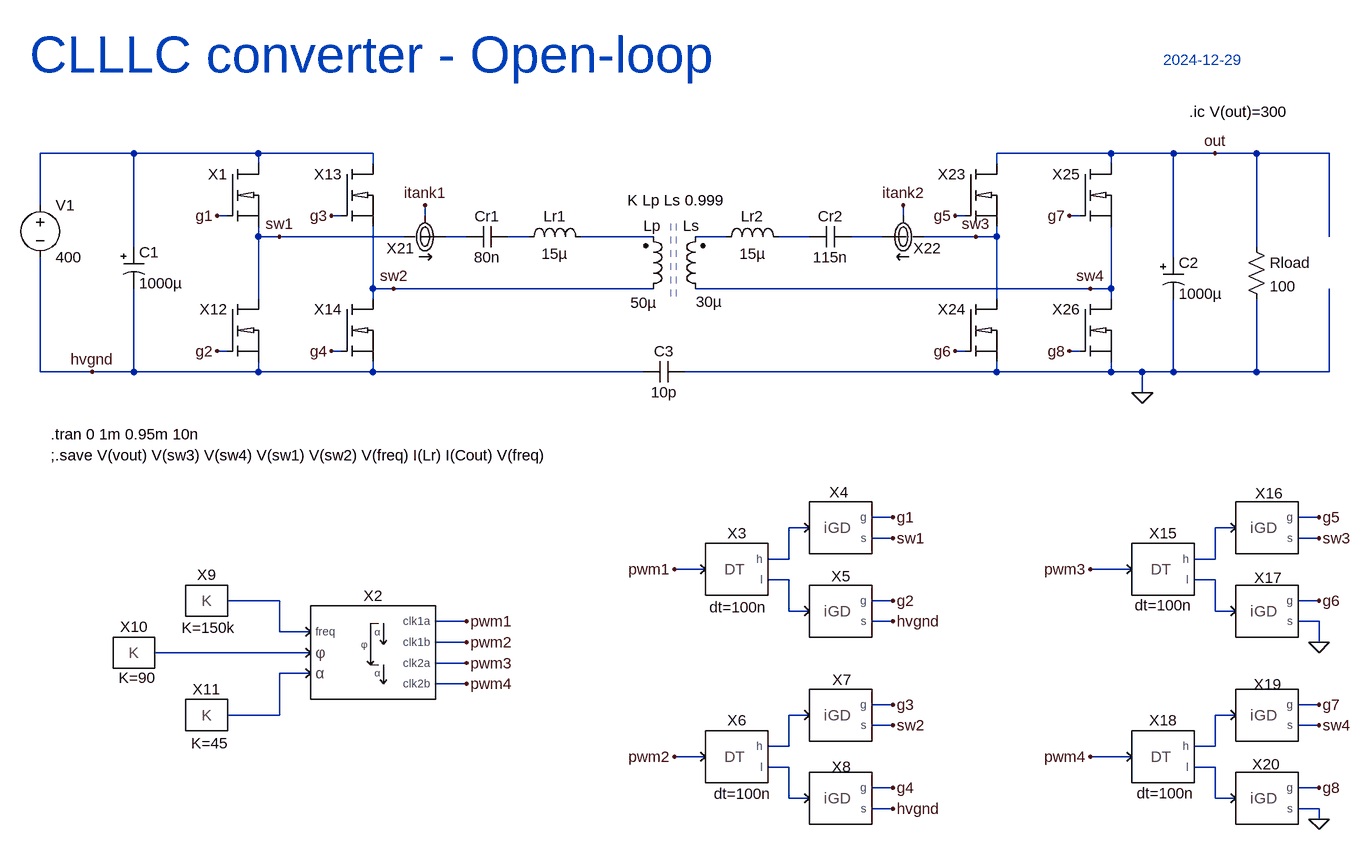
[diagram p0: schematic CLLC_Openloop.asc]
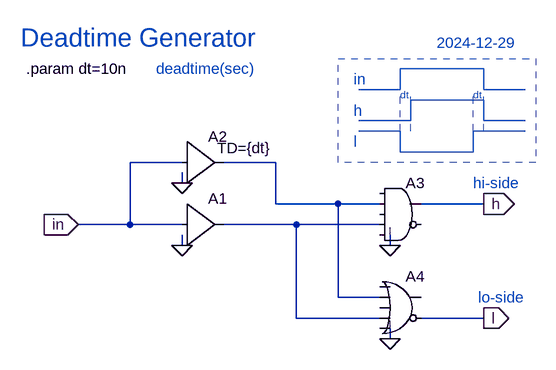
[diagram p1: sub-circuit deadtime.asc]
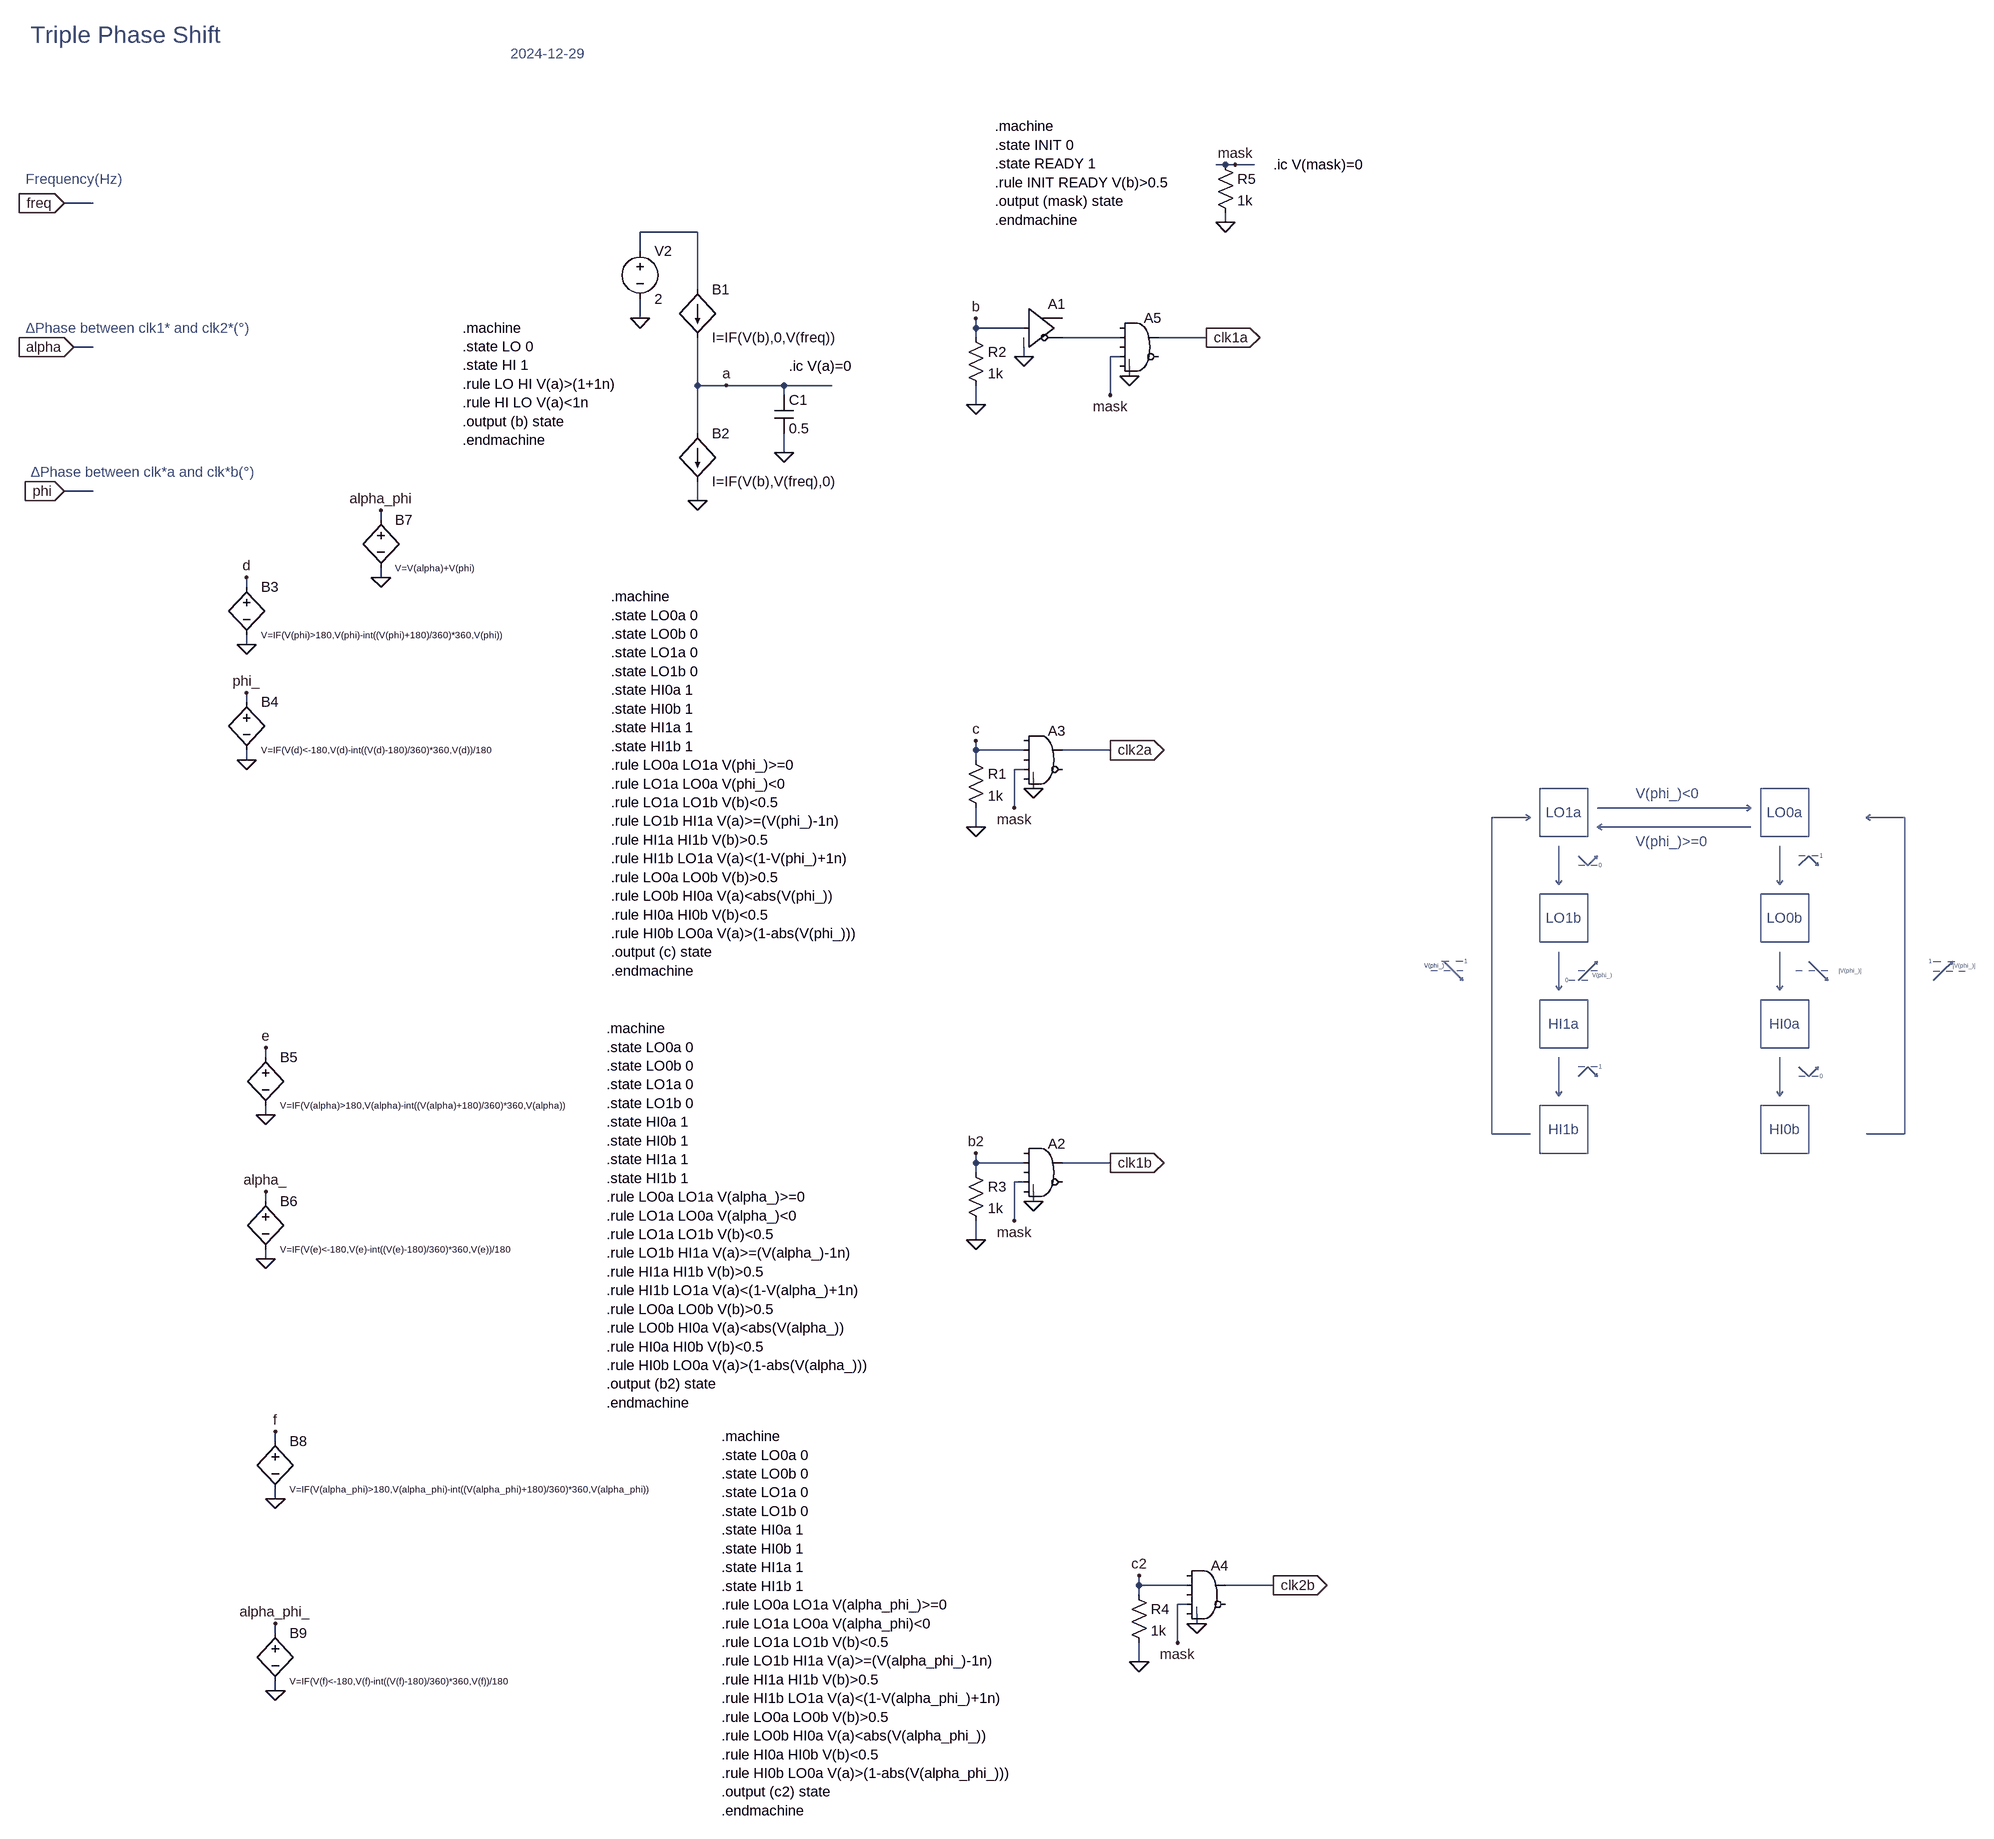
[diagram p2: sub-circuit phaseshift3.asc]
CLLC_Openloop.asc, the LTspice schematic file:
Version 4
SHEET 1 2384 1372
WIRE -80 -16 -224 -16
WIRE 112 -16 -80 -16
WIRE 288 -16 112 -16
WIRE 1424 -16 1248 -16
WIRE 1520 -16 1424 -16
WIRE 1584 -16 1520 -16
WIRE 1648 -16 1584 -16
WIRE 1760 -16 1648 -16
WIRE 112 0 112 -16
WIRE 288 0 288 -16
WIRE 1248 0 1248 -16
WIRE 1424 0 1424 -16
WIRE -224 64 -224 -16
WIRE 64 80 48 80
WIRE 240 80 224 80
WIRE 368 80 368 64
WIRE 1104 80 1104 64
WIRE 1200 80 1184 80
WIRE 1376 80 1360 80
WIRE 112 112 112 96
WIRE 144 112 112 112
WIRE 336 112 144 112
WIRE 432 112 400 112
WIRE 528 112 496 112
WIRE 720 112 608 112
WIRE 832 112 784 112
WIRE 960 112 912 112
WIRE 1072 112 1024 112
WIRE 1216 112 1136 112
WIRE 1248 112 1248 96
WIRE 1248 112 1216 112
WIRE 1760 112 1760 -16
WIRE -80 128 -80 -16
WIRE 1648 128 1648 -16
WIRE 1520 144 1520 -16
WIRE 288 192 288 96
WIRE 320 192 288 192
WIRE 720 192 320 192
WIRE 1392 192 784 192
WIRE 1424 192 1424 96
WIRE 1424 192 1392 192
WIRE 112 208 112 112
WIRE 288 208 288 192
WIRE 1248 208 1248 112
WIRE 1424 208 1424 192
WIRE 64 288 48 288
WIRE 240 288 224 288
WIRE 1200 288 1184 288
WIRE 1376 288 1360 288
WIRE -224 320 -224 144
WIRE -144 320 -224 320
WIRE -80 320 -80 192
WIRE -80 320 -144 320
WIRE 112 320 112 304
WIRE 112 320 -80 320
WIRE 288 320 288 304
WIRE 288 320 112 320
WIRE 704 320 288 320
WIRE 1248 320 1248 304
WIRE 1248 320 768 320
WIRE 1424 320 1424 304
WIRE 1424 320 1248 320
WIRE 1472 320 1424 320
WIRE 1520 320 1520 208
WIRE 1520 320 1472 320
WIRE 1648 320 1648 208
WIRE 1648 320 1520 320
WIRE 1760 320 1760 192
WIRE 1760 320 1648 320
WIRE 1472 352 1472 320
WIRE 1088 544 1056 544
WIRE 1744 544 1712 544
WIRE 960 560 928 560
WIRE 1616 560 1584 560
WIRE 1088 576 1056 576
WIRE 1744 576 1712 576
WIRE 928 608 928 560
WIRE 928 608 896 608
WIRE 1584 608 1584 560
WIRE 1584 608 1552 608
WIRE 800 624 752 624
WIRE 1456 624 1392 624
WIRE 928 640 896 640
WIRE 1584 640 1552 640
WIRE 144 672 64 672
WIRE 1088 672 1056 672
WIRE 1744 672 1712 672
WIRE 928 688 928 640
WIRE 960 688 928 688
WIRE 1584 688 1584 640
WIRE 1616 688 1584 688
WIRE 432 704 384 704
WIRE 1088 704 1056 704
WIRE 1744 704 1712 704
WIRE 144 720 144 672
WIRE 192 720 144 720
WIRE 432 736 384 736
WIRE 1744 736 1744 704
WIRE 192 752 -48 752
WIRE 432 768 384 768
WIRE 192 784 144 784
WIRE 432 800 384 800
WIRE 1088 832 1056 832
WIRE 1744 832 1712 832
WIRE 144 848 144 784
WIRE 144 848 64 848
WIRE 960 848 928 848
WIRE 1616 848 1584 848
WIRE 1088 864 1056 864
WIRE 1744 864 1712 864
WIRE 928 896 928 848
WIRE 928 896 896 896
WIRE 1584 896 1584 848
WIRE 1584 896 1552 896
WIRE 800 912 752 912
WIRE 1456 912 1392 912
WIRE 928 928 896 928
WIRE 1584 928 1552 928
WIRE 1088 960 1056 960
WIRE 1744 960 1712 960
WIRE 928 976 928 928
WIRE 960 976 928 976
WIRE 1584 976 1584 928
WIRE 1616 976 1584 976
WIRE 1088 992 1056 992
WIRE 1744 992 1712 992
WIRE 1744 1008 1744 992
FLAG 48 80 g1
FLAG 48 288 g2
FLAG 144 112 sw1
FLAG 224 80 g3
FLAG 224 288 g4
FLAG 320 192 sw2
FLAG 1584 -16 out
FLAG 1088 544 g1
FLAG 1088 576 sw1
FLAG 1088 672 g2
FLAG 1088 832 g3
FLAG 1088 864 sw2
FLAG 1088 960 g4
FLAG -144 320 hvgnd
FLAG 1088 992 hvgnd
FLAG 1088 704 hvgnd
FLAG 1216 112 sw3
FLAG 1392 192 sw4
FLAG 1472 352 0
FLAG 1184 80 g5
FLAG 1184 288 g6
FLAG 1360 80 g7
FLAG 1360 288 g8
FLAG 1744 544 g5
FLAG 1744 576 sw3
FLAG 1744 672 g6
FLAG 1744 832 g7
FLAG 1744 864 sw4
FLAG 1744 960 g8
FLAG 1744 1008 0
FLAG 1744 736 0
FLAG 368 64 itank1
FLAG 1104 64 itank2
FLAG 752 912 pwm2
FLAG 432 736 pwm2
FLAG 432 704 pwm1
FLAG 432 800 pwm4
FLAG 432 768 pwm3
FLAG 752 624 pwm1
FLAG 1392 624 pwm3
FLAG 1392 912 pwm4
SYMBOL voltage -224 48 R0
WINDOW 123 0 0 Left 0
WINDOW 39 0 0 Left 0
SYMATTR InstName V1
SYMATTR Value 400
SYMBOL ind2 704 208 M180
WINDOW 0 0 113 Left 2
WINDOW 3 -20 -6 Left 2
SYMATTR InstName Lp
SYMATTR Value 50µ
SYMATTR SpiceLine Rser=1m
SYMBOL ind2 800 208 R180
WINDOW 0 9 113 Left 2
WINDOW 3 -26 -4 Left 2
SYMATTR InstName Ls
SYMATTR Value 30µ
SYMATTR SpiceLine Rser=1m
SYMBOL DEADTIME 848 624 R0
WINDOW 39 2 74 Bottom 2
SYMATTR SpiceLine dt=100n
SYMATTR InstName X3
SYMBOL iGD 1008 560 R0
WINDOW 0 -3 -70 Top 2
SYMATTR InstName X4
SYMBOL iGD 1008 688 R0
WINDOW 0 0 -69 Top 2
SYMATTR InstName X5
SYMBOL DEADTIME 848 912 R0
WINDOW 39 9 73 Bottom 2
SYMATTR SpiceLine dt=100n
SYMATTR InstName X6
SYMBOL iGD 1008 848 R0
WINDOW 0 2 -70 Top 2
SYMATTR InstName X7
SYMBOL iGD 1008 976 R0
WINDOW 0 1 -64 Top 2
SYMATTR InstName X8
SYMBOL cap 496 96 R90
WINDOW 0 0 32 VBottom 2
WINDOW 3 32 32 VTop 2
SYMATTR InstName Cr1
SYMATTR Value 80n
SYMBOL ind 512 128 R270
WINDOW 0 32 56 VTop 2
WINDOW 3 5 56 VBottom 2
SYMATTR InstName Lr1
SYMATTR Value 15µ
SYMATTR SpiceLine Rser=10m
SYMBOL ind 816 128 R270
WINDOW 0 32 56 VTop 2
WINDOW 3 5 56 VBottom 2
SYMATTR InstName Lr2
SYMATTR Value 15µ
SYMATTR SpiceLine Rser=10m
SYMBOL cap 1024 96 R90
WINDOW 0 0 32 VBottom 2
WINDOW 3 32 32 VTop 2
SYMATTR InstName Cr2
SYMATTR Value 115n
SYMBOL DEADTIME 1504 624 R0
WINDOW 39 1 71 Bottom 2
SYMATTR SpiceLine dt=100n
SYMATTR InstName X15
SYMBOL iGD 1664 560 R0
WINDOW 0 3 -69 Top 2
SYMATTR InstName X16
SYMBOL iGD 1664 688 R0
WINDOW 0 2 -67 Top 2
SYMATTR InstName X17
SYMBOL DEADTIME 1504 912 R0
WINDOW 39 4 72 Bottom 2
SYMATTR SpiceLine dt=100n
SYMATTR InstName X18
SYMBOL iGD 1664 848 R0
WINDOW 0 1 -63 Top 2
SYMATTR InstName X19
SYMBOL iGD 1664 976 R0
WINDOW 0 -1 -68 Top 2
SYMATTR InstName X20
SYMBOL IMON 368 112 M180
SYMATTR InstName X21
SYMBOL IMON 1104 112 R180
SYMATTR InstName X22
SYMBOL PHASESHIFT3 288 752 R0
SYMATTR InstName X2
SYMBOL CONST 32 672 R0
WINDOW 39 3 57 Bottom 2
SYMATTR SpiceLine K=150k
SYMATTR InstName X9
SYMBOL CONST -80 752 R0
WINDOW 39 5 54 Bottom 2
SYMATTR SpiceLine K=90
SYMATTR InstName X10
SYMBOL CONST 32 848 R0
WINDOW 39 5 59 Bottom 2
SYMATTR SpiceLine K=45
SYMATTR InstName X11
SYMBOL polcap -96 128 R0
WINDOW 3 24 56 Left 2
SYMATTR Value 1000µ
SYMATTR InstName C1
SYMATTR Description Capacitor
SYMATTR Type cap
SYMATTR SpiceLine Rser=0.03
SYMBOL polcap 1504 144 R0
WINDOW 3 24 56 Left 2
SYMATTR Value 1000µ
SYMATTR InstName C2
SYMATTR Description Capacitor
SYMATTR Type cap
SYMATTR SpiceLine Rser=0.03
SYMBOL res 1632 112 R0
SYMATTR InstName Rload
SYMATTR Value 100
SYMBOL cap 768 304 R90
WINDOW 0 0 32 VBottom 2
WINDOW 3 32 32 VTop 2
SYMATTR InstName C3
SYMATTR Value 10p
SYMBOL iNMOS 112 48 R0
SYMATTR InstName X1
SYMBOL iNMOS 112 256 R0
SYMATTR InstName X12
SYMBOL iNMOS 288 48 R0
SYMATTR InstName X13
SYMBOL iNMOS 288 256 R0
SYMATTR InstName X14
SYMBOL iNMOS 1248 48 R0
SYMATTR InstName X23
SYMBOL iNMOS 1248 256 R0
SYMATTR InstName X24
SYMBOL iNMOS 1424 48 R0
SYMATTR InstName X25
SYMBOL iNMOS 1424 256 R0
SYMATTR InstName X26
TEXT 680 56 Left 2 !K Lp Ls 0.999
TEXT -208 416 Left 2 !.tran 0 1m 0.95m 10n
TEXT -240 -168 Left 6 ;CLLLC converter - Open-loop
TEXT -208 448 Left 2 !;.save V(vout) V(sw3) V(sw4) V(sw1) V(sw2) V(freq) I(Lr) I(Cout) V(freq)
TEXT 1544 -80 Left 2 !.ic V(out)=300
TEXT 1504 -160 Left 2 ;2024-12-29
LINE Normal 747 204 747 92 1
LINE Normal 755 204 755 92 1

deadtime.asc, the sub-circuit schematic file:
Version 4
SHEET 1 1412 1312
WIRE 64 288 -16 288
WIRE 208 288 128 288
WIRE 64 320 64 304
WIRE 208 352 208 288
WIRE 304 352 208 352
WIRE 368 352 304 352
WIRE 528 352 432 352
WIRE -16 384 -16 288
WIRE -16 384 -96 384
WIRE 64 384 -16 384
WIRE 240 384 128 384
WIRE 368 384 240 384
WIRE 64 416 64 400
WIRE 384 416 384 400
WIRE 304 496 304 352
WIRE 368 496 304 496
WIRE 240 528 240 384
WIRE 368 528 240 528
WIRE 528 528 432 528
WIRE 384 560 384 544
FLAG -96 384 in
IOPIN -96 384 In
FLAG 64 416 0
FLAG 64 320 0
FLAG 384 416 0
FLAG 384 560 0
FLAG 528 352 h
IOPIN 528 352 Out
FLAG 528 528 l
IOPIN 528 528 Out
SYMBOL Digital\\buf1 64 320 R0
SYMATTR InstName A1
SYMBOL Digital\\buf1 64 224 R0
WINDOW 3 54 42 Left 2
SYMATTR Value TD={dt}
SYMATTR InstName A2
SYMBOL Digital\\and 400 304 R0
SYMATTR InstName A3
SYMBOL Digital\\or 400 448 R0
SYMATTR InstName A4
TEXT -176 144 Left 2 !.param dt=10n
TEXT -184 96 Left 4 ;Deadtime Generator
TEXT 24 144 Left 2 ;deadtime(sec)
TEXT 512 320 Left 2 ;hi-side
TEXT 520 496 Left 2 ;lo-side
TEXT 328 160 Left 2 ;in
TEXT 328 208 Left 2 ;h
TEXT 328 256 Left 2 ;l
TEXT 400 184 Left 1 ;dt
TEXT 512 184 Left 1 ;dt
TEXT 456 104 Left 2 ;2024-12-29
LINE Normal 400 176 336 176
LINE Normal 400 176 400 144
LINE Normal 528 144 400 144
LINE Normal 528 176 528 144
LINE Normal 592 176 528 176
LINE Normal 416 224 336 224
LINE Normal 416 224 416 192
LINE Normal 528 192 416 192
LINE Normal 528 224 528 192
LINE Normal 592 224 528 224
LINE Normal 400 240 336 240
LINE Normal 400 272 400 240
LINE Normal 512 272 400 272
LINE Normal 512 272 512 240
LINE Normal 592 240 512 240
LINE Normal 400 240 400 176 2
LINE Normal 512 240 512 176 2
LINE Normal 416 240 416 176 2
LINE Normal 528 240 528 176 2
RECTANGLE Normal 608 288 304 128 2

phaseshift3.asc, the sub-circuit schematic file:
Version 4
SHEET 1 2476 2456
WIRE 752 -240 736 -240
WIRE 768 -240 752 -240
WIRE 800 -240 768 -240
WIRE -1136 -176 -1184 -176
WIRE 752 -144 752 -160
WIRE -128 -128 -224 -128
WIRE -224 -96 -224 -128
WIRE -128 -32 -128 -128
WIRE -224 16 -224 -16
WIRE 336 32 336 16
WIRE 416 32 336 32
WIRE 336 48 336 32
WIRE 576 48 480 48
WIRE 720 48 640 48
WIRE -1136 64 -1168 64
WIRE 416 80 416 64
WIRE 576 80 560 80
WIRE 592 112 592 96
WIRE -128 128 -128 48
WIRE -80 128 -128 128
WIRE 16 128 -80 128
WIRE 96 128 16 128
WIRE 16 144 16 128
WIRE 560 144 560 80
WIRE 336 160 336 128
WIRE -128 208 -128 128
WIRE 16 240 16 208
WIRE -1136 304 -1184 304
WIRE -128 320 -128 288
WIRE -656 352 -656 336
WIRE -656 448 -656 432
WIRE -880 464 -880 448
WIRE -880 560 -880 544
WIRE -880 656 -880 640
WIRE 336 736 336 720
WIRE 416 736 336 736
WIRE 560 736 480 736
WIRE -880 752 -880 736
WIRE 336 752 336 736
WIRE 416 768 400 768
WIRE 432 800 432 784
WIRE 400 832 400 768
WIRE 336 864 336 832
WIRE -848 1248 -848 1232
WIRE -848 1344 -848 1328
WIRE 336 1424 336 1408
WIRE 416 1424 336 1424
WIRE 560 1424 480 1424
WIRE 336 1440 336 1424
WIRE 416 1456 400 1456
WIRE -848 1488 -848 1472
WIRE 432 1488 432 1472
WIRE 400 1520 400 1456
WIRE 336 1552 336 1520
WIRE -848 1584 -848 1568
WIRE -832 1888 -832 1872
WIRE -832 1984 -832 1968
WIRE 608 2128 608 2112
WIRE 688 2128 608 2128
WIRE 832 2128 752 2128
WIRE 608 2144 608 2128
WIRE 688 2160 672 2160
WIRE 704 2192 704 2176
WIRE -832 2208 -832 2192
WIRE 672 2224 672 2160
WIRE 608 2256 608 2224
WIRE -832 2304 -832 2288
FLAG -1184 -176 freq
IOPIN -1184 -176 In
FLAG 16 240 0
FLAG -224 16 0
FLAG -1168 64 alpha
IOPIN -1168 64 In
FLAG -128 320 0
FLAG 336 160 0
FLAG -80 128 a
FLAG -880 560 0
FLAG -880 448 d
FLAG 720 48 clk1a
IOPIN 720 48 Out
FLAG 336 16 b
FLAG 336 864 0
FLAG 560 736 clk2a
IOPIN 560 736 Out
FLAG 336 720 c
FLAG -880 752 0
FLAG -880 640 phi_
FLAG 336 1552 0
FLAG 560 1424 clk1b
IOPIN 560 1424 Out
FLAG 336 1408 b2
FLAG 608 2256 0
FLAG 832 2128 clk2b
IOPIN 832 2128 Out
FLAG 608 2112 c2
FLAG -1184 304 phi
IOPIN -1184 304 In
FLAG -848 1344 0
FLAG -848 1232 e
FLAG -848 1584 0
FLAG -848 1472 alpha_
FLAG -656 448 0
FLAG -656 336 alpha_phi
FLAG -832 1984 0
FLAG -832 1872 f
FLAG -832 2304 0
FLAG -832 2192 alpha_phi_
FLAG 416 80 0
FLAG 592 112 0
FLAG 560 144 mask
FLAG 432 800 0
FLAG 400 832 mask
FLAG 432 1488 0
FLAG 400 1520 mask
FLAG 704 2192 0
FLAG 672 2224 mask
FLAG 752 -144 0
FLAG 768 -240 mask
SYMBOL cap 0 144 R0
SYMATTR InstName C1
SYMATTR Value 0.5
SYMBOL voltage -224 -112 R0
WINDOW 123 0 0 Left 0
WINDOW 39 0 0 Left 0
SYMATTR InstName V2
SYMATTR Value 2
SYMBOL bi -128 -32 R0
SYMATTR InstName B1
SYMATTR Value I=IF(V(b),0,V(freq))
SYMBOL bi -128 208 R0
SYMATTR InstName B2
SYMATTR Value I=IF(V(b),V(freq),0)
SYMBOL res 320 32 R0
SYMATTR InstName R2
SYMATTR Value 1k
SYMBOL bv -880 448 R0
WINDOW 3 24 96 Left 1
SYMATTR Value V=IF(V(phi)>180,V(phi)-int((V(phi)+180)/360)*360,V(phi))
SYMATTR InstName B3
SYMBOL Digital\\buf 416 -32 R0
SYMATTR InstName A1
SYMBOL res 320 736 R0
SYMATTR InstName R1
SYMATTR Value 1k
SYMBOL bv -880 640 R0
WINDOW 3 24 96 Left 1
SYMATTR Value V=IF(V(d)<-180,V(d)-int((V(d)-180)/360)*360,V(d))/180
SYMATTR InstName B4
SYMBOL res 320 1424 R0
SYMATTR InstName R3
SYMATTR Value 1k
SYMBOL res 592 2128 R0
SYMATTR InstName R4
SYMATTR Value 1k
SYMBOL bv -848 1232 R0
WINDOW 3 24 96 Left 1
SYMATTR Value V=IF(V(alpha)>180,V(alpha)-int((V(alpha)+180)/360)*360,V(alpha))
SYMATTR InstName B5
SYMBOL bv -848 1472 R0
WINDOW 3 24 96 Left 1
SYMATTR Value V=IF(V(e)<-180,V(e)-int((V(e)-180)/360)*360,V(e))/180
SYMATTR InstName B6
SYMBOL bv -656 336 R0
WINDOW 3 24 96 Left 1
SYMATTR Value V=V(alpha)+V(phi)
SYMATTR InstName B7
SYMBOL bv -832 1872 R0
WINDOW 3 24 96 Left 1
SYMATTR Value V=IF(V(alpha_phi)>180,V(alpha_phi)-int((V(alpha_phi)+180)/360)*360,V(alpha_phi))
SYMATTR InstName B8
SYMBOL bv -832 2192 R0
WINDOW 3 24 96 Left 1
SYMATTR Value V=IF(V(f)<-180,V(f)-int((V(f)-180)/360)*360,V(f))/180
SYMATTR InstName B9
SYMBOL Digital\\and 608 0 R0
SYMATTR InstName A5
SYMBOL Digital\\and 448 688 R0
SYMATTR InstName A3
SYMBOL Digital\\and 448 1376 R0
SYMATTR InstName A2
SYMBOL Digital\\and 720 2080 R0
SYMATTR InstName A4
SYMBOL res 736 -256 R0
SYMATTR InstName R5
SYMATTR Value 1k
TEXT -520 32 Left 2 !.machine\n.state LO 0\n.state HI 1\n.rule LO HI V(a)>(1+1n)\n.rule HI LO V(a)<1n\n.output (b) state\n.endmachine
TEXT 24 96 Left 2 !.ic V(a)=0
TEXT -272 480 Left 2 !.machine\n.state LO0a 0\n.state LO0b 0\n.state LO1a 0\n.state LO1b 0\n.state HI0a 1\n.state HI0b 1\n.state HI1a 1\n.state HI1b 1\n.rule LO0a LO1a V(phi_)>=0\n.rule LO1a LO0a V(phi_)<0\n.rule LO1a LO1b V(b)<0.5\n.rule LO1b HI1a V(a)>=(V(phi_)-1n)\n.rule HI1a HI1b V(b)>0.5\n.rule HI1b LO1a V(a)<(1-V(phi_)+1n)\n.rule LO0a LO0b V(b)>0.5\n.rule LO0b HI0a V(a)<abs(V(phi_))\n.rule HI0a HI0b V(b)<0.5\n.rule HI0b LO0a V(a)>(1-abs(V(phi_)))\n.output (c) state\n.endmachine
TEXT 832 -240 Left 2 !.ic V(mask)=0
TEXT -280 1200 Left 2 !.machine\n.state LO0a 0\n.state LO0b 0\n.state LO1a 0\n.state LO1b 0\n.state HI0a 1\n.state HI0b 1\n.state HI1a 1\n.state HI1b 1\n.rule LO0a LO1a V(alpha_)>=0\n.rule LO1a LO0a V(alpha_)<0\n.rule LO1a LO1b V(b)<0.5\n.rule LO1b HI1a V(a)>=(V(alpha_)-1n)\n.rule HI1a HI1b V(b)>0.5\n.rule HI1b LO1a V(a)<(1-V(alpha_)+1n)\n.rule LO0a LO0b V(b)>0.5\n.rule LO0b HI0a V(a)<abs(V(alpha_))\n.rule HI0a HI0b V(b)<0.5\n.rule HI0b LO0a V(a)>(1-abs(V(alpha_)))\n.output (b2) state\n.endmachine
TEXT -88 1880 Left 2 !.machine\n.state LO0a 0\n.state LO0b 0\n.state LO1a 0\n.state LO1b 0\n.state HI0a 1\n.state HI0b 1\n.state HI1a 1\n.state HI1b 1\n.rule LO0a LO1a V(alpha_phi_)>=0\n.rule LO1a LO0a V(alpha_phi)<0\n.rule LO1a LO1b V(b)<0.5\n.rule LO1b HI1a V(a)>=(V(alpha_phi_)-1n)\n.rule HI1a HI1b V(b)>0.5\n.rule HI1b LO1a V(a)<(1-V(alpha_phi_)+1n)\n.rule LO0a LO0b V(b)>0.5\n.rule LO0b HI0a V(a)<abs(V(alpha_phi_))\n.rule HI0a HI0b V(b)<0.5\n.rule HI0b LO0a V(a)>(1-abs(V(alpha_phi_)))\n.output (c2) state\n.endmachine
TEXT 368 -304 Left 2 !.machine\n.state INIT 0\n.state READY 1\n.rule INIT READY V(b)>0.5\n.output (mask) state\n.endmachine
TEXT 1416 840 Center 2 ;LO1a
TEXT 1784 840 Center 2 ;LO0a
TEXT 1536 808 Left 2 ;V(phi_)<0
TEXT 1656 888 Right 2 ;V(phi_)>=0
TEXT 1480 928 Right 0 ;0
TEXT 1416 1016 Center 2 ;LO1b
TEXT 1496 1112 Right 0 ;V(phi_)
TEXT 1424 1120 Right 0 ;0
TEXT 1416 1192 Center 2 ;HI1a
TEXT 1480 1264 Right 0 ;1
TEXT 1416 1368 Center 2 ;HI1b
TEXT 1256 1088 Right 0 ;1
TEXT 1216 1096 Right 0 ;V(phi_)
TEXT 1784 1016 Center 2 ;LO0b
TEXT 1784 1192 Center 2 ;HI0a
TEXT 1784 1368 Center 2 ;HI0b
TEXT 1848 912 Right 0 ;1
TEXT 1216 1096 Right 0 ;V(phi_)
TEXT 1912 1104 Right 0 ;|V(phi_)|
TEXT 1848 1280 Right 0 ;0
TEXT 2024 1088 Left 0 ;1
TEXT 2064 1096 Left 0 ;|V(phi_)|
TEXT -1240 -480 Left 4 ;Triple Phase Shift
TEXT -1248 -216 Left 2 ;Frequency(Hz)
TEXT -1248 32 Left 2 ;ΔPhase between clk1* and clk2*(°)
TEXT -1240 272 Left 2 ;ΔPhase between clk*a and clk*b(°)
TEXT -440 -448 Left 2 ;2024-12-29
LINE Normal 1728 832 1472 832
LINE Normal 1728 832 1728 832 2
LINE Normal 1721 837 1728 832
LINE Normal 1728 832 1721 827
LINE Normal 1472 864 1728 864
LINE Normal 1472 864 1472 864 2
LINE Normal 1479 869 1472 864
LINE Normal 1472 864 1479 859
LINE Normal 1408 960 1408 896
LINE Normal 1408 960 1408 960 2
LINE Normal 1413 953 1408 960
LINE Normal 1408 960 1403 953
LINE Normal 1456 928 1440 912
LINE Normal 1472 912 1456 928
LINE Normal 1472 928 1440 928 2
LINE Normal 1471 917 1472 912
LINE Normal 1467 913 1472 912
LINE Normal 1408 1136 1408 1072
LINE Normal 1408 1136 1408 1136 2
LINE Normal 1413 1129 1408 1136
LINE Normal 1408 1136 1403 1129
LINE Normal 1472 1088 1456 1104
LINE Normal 1472 1104 1440 1104 2
LINE Normal 1471 1093 1472 1088
LINE Normal 1467 1089 1472 1088
LINE Normal 1456 1104 1440 1120
LINE Normal 1456 1120 1424 1120 2
LINE Normal 1408 1136 1408 1136 2
LINE Normal 1408 1312 1408 1248
LINE Normal 1408 1312 1408 1312 2
LINE Normal 1413 1305 1408 1312
LINE Normal 1408 1312 1403 1305
LINE Normal 1456 1264 1440 1280
LINE Normal 1472 1280 1456 1264
LINE Normal 1472 1264 1440 1264 2
LINE Normal 1471 1275 1472 1280
LINE Normal 1467 1279 1472 1280
LINE Normal 1360 848 1296 848
LINE Normal 1360 848 1360 848 2
LINE Normal 1353 843 1360 848
LINE Normal 1360 848 1353 853
LINE Normal 1296 1376 1296 848
LINE Normal 1296 1376 1360 1376
LINE Normal 1232 1104 1216 1088
LINE Normal 1248 1120 1232 1104
LINE Normal 1248 1104 1184 1104 2
LINE Normal 1247 1115 1248 1120
LINE Normal 1243 1119 1248 1120
LINE Normal 1248 1088 1200 1088 2
LINE Normal 1776 960 1776 896
LINE Normal 1776 960 1776 960 2
LINE Normal 1781 953 1776 960
LINE Normal 1776 960 1771 953
LINE Normal 1776 1136 1776 1072
LINE Normal 1776 1136 1776 1136 2
LINE Normal 1781 1129 1776 1136
LINE Normal 1776 1136 1771 1129
LINE Normal 1776 1136 1776 1136 2
LINE Normal 1776 1312 1776 1248
LINE Normal 1776 1312 1776 1312 2
LINE Normal 1781 1305 1776 1312
LINE Normal 1776 1312 1771 1305
LINE Normal 1824 912 1808 928
LINE Normal 1840 928 1824 912
LINE Normal 1840 912 1808 912 2
LINE Normal 1839 923 1840 928
LINE Normal 1835 927 1840 928
LINE Normal 1232 1104 1216 1088
LINE Normal 1248 1120 1232 1104
LINE Normal 1248 1104 1184 1104 2
LINE Normal 1247 1115 1248 1120
LINE Normal 1243 1119 1248 1120
LINE Normal 1248 1088 1200 1088 2
LINE Normal 1840 1104 1824 1088
LINE Normal 1856 1120 1840 1104
LINE Normal 1856 1104 1792 1104 2
LINE Normal 1855 1115 1856 1120
LINE Normal 1851 1119 1856 1120
LINE Normal 1840 1104 1824 1088
LINE Normal 1856 1120 1840 1104
LINE Normal 1856 1104 1792 1104 2
LINE Normal 1855 1115 1856 1120
LINE Normal 1851 1119 1856 1120
LINE Normal 1824 1280 1808 1264
LINE Normal 1840 1264 1824 1280
LINE Normal 1840 1280 1808 1280 2
LINE Normal 1839 1269 1840 1264
LINE Normal 1835 1265 1840 1264
LINE Normal 1920 848 1984 848
LINE Normal 1920 848 1920 848 2
LINE Normal 1927 843 1920 848
LINE Normal 1920 848 1927 853
LINE Normal 1984 1376 1984 848
LINE Normal 1984 1376 1920 1376
LINE Normal 2048 1104 2064 1088
LINE Normal 2032 1120 2048 1104
LINE Normal 2032 1104 2096 1104 2
LINE Normal 2063 1093 2064 1088
LINE Normal 2059 1089 2064 1088
LINE Normal 2032 1088 2080 1088 2
LINE Normal 2048 1104 2064 1088
LINE Normal 2032 1120 2048 1104
LINE Normal 2032 1104 2096 1104 2
LINE Normal 2063 1093 2064 1088
LINE Normal 2059 1089 2064 1088
LINE Normal 2032 1088 2080 1088 2
RECTANGLE Normal 1456 880 1376 800
RECTANGLE Normal 1824 880 1744 800
RECTANGLE Normal 1456 1056 1376 976
RECTANGLE Normal 1456 1232 1376 1152
RECTANGLE Normal 1456 1408 1376 1328
RECTANGLE Normal 1824 1056 1744 976
RECTANGLE Normal 1824 1232 1744 1152
RECTANGLE Normal 1824 1408 1744 1328

The netlist it stands for:
* CLLC_Openloop.asc
V1 N001 hvgnd 400
Lp sw2 N004 50µ Rser=1m
Ls sw4 N005 30µ Rser=1m
XX3 pwm1 N010 N008 deadtime params: dt=100n
XX4 N008 g1 sw1 iGD  ; pins in g s
XX5 N010 g2 hvgnd iGD  ; pins in g s
XX6 pwm2 N017 N015 deadtime params: dt=100n
XX7 N015 g3 sw2 iGD  ; pins in g s
XX8 N017 g4 hvgnd iGD  ; pins in g s
Cr1 N003 N002 80n
Lr1 N003 N004 15µ Rser=10m
Lr2 N005 N006 15µ Rser=10m
Cr2 N007 N006 115n
XX15 pwm3 N011 N009 deadtime params: dt=100n
XX16 N009 g5 sw3 iGD  ; pins in g s
XX17 N011 g6 0 iGD  ; pins in g s
XX18 pwm4 N018 N016 deadtime params: dt=100n
XX19 N016 g7 sw4 iGD  ; pins in g s
XX20 N018 g8 0 iGD  ; pins in g s
XX21 N002 itank1 sw1 IMON rsns=10u  ; pins n out p
XX22 N007 itank2 sw3 IMON rsns=10u  ; pins n out p
XX2 N014 N012 N013 pwm1 pwm2 pwm3 pwm4 phaseshift3
XX9 N012 CONST K=150k  ; pins K
XX10 N013 CONST K=90  ; pins K
XX11 N014 CONST K=45  ; pins K
C1 N001 hvgnd 1000µ Rser=0.03
C2 out 0 1000µ Rser=0.03
Rload out 0 100
C3 0 hvgnd 10p
XX1 N001 g1 sw1 iNMOS params: esl=1f rsnb=1k csnb=10p ron=10m  ; pins D G S
XX12 sw1 g2 hvgnd iNMOS params: esl=1f rsnb=1k csnb=10p ron=10m  ; pins D G S
XX13 N001 g3 sw2 iNMOS params: esl=1f rsnb=1k csnb=10p ron=10m  ; pins D G S
XX14 sw2 g4 hvgnd iNMOS params: esl=1f rsnb=1k csnb=10p ron=10m  ; pins D G S
XX23 out g5 sw3 iNMOS params: esl=1f rsnb=1k csnb=10p ron=10m  ; pins D G S
XX24 sw3 g6 0 iNMOS params: esl=1f rsnb=1k csnb=10p ron=10m  ; pins D G S
XX25 out g7 sw4 iNMOS params: esl=1f rsnb=1k csnb=10p ron=10m  ; pins D G S
XX26 sw4 g8 0 iNMOS params: esl=1f rsnb=1k csnb=10p ron=10m  ; pins D G S

* block symbol definitions
.subckt deadtime in l h
A1 in 0 0 0 0 0 N002 0 BUF
A2 in 0 0 0 0 0 N001 0 BUF TD={dt}
A3 0 N001 0 N002 0 0 h 0 AND
A4 0 N001 0 N002 0 l 0 0 OR
.param dt=10n
* Deadtime Generator
* deadtime(sec)
* hi-side
* lo-side
* in
* h
* l
* dt
* dt
* 2024-12-29
.ends deadtime

.subckt phaseshift3 alpha freq phi clk1a clk1b clk2a clk2b
C1 a 0 0.5
V2 N001 0 2
B1 N001 a I=IF(V(b),0,V(freq))
B2 a 0 I=IF(V(b),V(freq),0)
R2 b 0 1k
B3 d 0 V=IF(V(phi)>180,V(phi)-int((V(phi)+180)/360)*360,V(phi))
A1 b 0 0 0 0 N002 0 0 BUF
R1 c 0 1k
B4 phi_ 0 V=IF(V(d)<-180,V(d)-int((V(d)-180)/360)*360,V(d))/180
R3 b2 0 1k
R4 c2 0 1k
B5 e 0 V=IF(V(alpha)>180,V(alpha)-int((V(alpha)+180)/360)*360,V(alpha))
B6 alpha_ 0 V=IF(V(e)<-180,V(e)-int((V(e)-180)/360)*360,V(e))/180
B7 alpha_phi 0 V=V(alpha)+V(phi)
B8 f 0 V=IF(V(alpha_phi)>180,V(alpha_phi)-int((V(alpha_phi)+180)/360)*360,V(alpha_phi))
B9 alpha_phi_ 0 V=IF(V(f)<-180,V(f)-int((V(f)-180)/360)*360,V(f))/180
A5 0 N002 0 mask 0 0 clk1a 0 AND
A3 0 c 0 mask 0 0 clk2a 0 AND
A2 0 b2 0 mask 0 0 clk1b 0 AND
A4 0 c2 0 mask 0 0 clk2b 0 AND
R5 mask 0 1k
.machine
.state LO 0
.state HI 1
.rule LO HI V(a)>(1+1n)
.rule HI LO V(a)<1n
.output (b) state
.endmachine
.ic V(a)=0
.machine
.state LO0a 0
.state LO0b 0
.state LO1a 0
.state LO1b 0
.state HI0a 1
.state HI0b 1
.state HI1a 1
.state HI1b 1
.rule LO0a LO1a V(phi_)>=0
.rule LO1a LO0a V(phi_)<0
.rule LO1a LO1b V(b)<0.5
.rule LO1b HI1a V(a)>=(V(phi_)-1n)
.rule HI1a HI1b V(b)>0.5
.rule HI1b LO1a V(a)<(1-V(phi_)+1n)
.rule LO0a LO0b V(b)>0.5
.rule LO0b HI0a V(a)<abs(V(phi_))
.rule HI0a HI0b V(b)<0.5
.rule HI0b LO0a V(a)>(1-abs(V(phi_)))
.output (c) state
.endmachine
.ic V(mask)=0
.machine
.state LO0a 0
.state LO0b 0
.state LO1a 0
.state LO1b 0
.state HI0a 1
.state HI0b 1
.state HI1a 1
.state HI1b 1
.rule LO0a LO1a V(alpha_)>=0
.rule LO1a LO0a V(alpha_)<0
.rule LO1a LO1b V(b)<0.5
.rule LO1b HI1a V(a)>=(V(alpha_)-1n)
.rule HI1a HI1b V(b)>0.5
.rule HI1b LO1a V(a)<(1-V(alpha_)+1n)
.rule LO0a LO0b V(b)>0.5
.rule LO0b HI0a V(a)<abs(V(alpha_))
.rule HI0a HI0b V(b)<0.5
.rule HI0b LO0a V(a)>(1-abs(V(alpha_)))
.output (b2) state
.endmachine
.machine
.state LO0a 0
.state LO0b 0
.state LO1a 0
.state LO1b 0
.state HI0a 1
.state HI0b 1
.state HI1a 1
.state HI1b 1
.rule LO0a LO1a V(alpha_phi_)>=0
.rule LO1a LO0a V(alpha_phi)<0
.rule LO1a LO1b V(b)<0.5
.rule LO1b HI1a V(a)>=(V(alpha_phi_)-1n)
.rule HI1a HI1b V(b)>0.5
.rule HI1b LO1a V(a)<(1-V(alpha_phi_)+1n)
.rule LO0a LO0b V(b)>0.5
.rule LO0b HI0a V(a)<abs(V(alpha_phi_))
.rule HI0a HI0b V(b)<0.5
.rule HI0b LO0a V(a)>(1-abs(V(alpha_phi_)))
.output (c2) state
.endmachine
.machine
.state INIT 0
.state READY 1
.rule INIT READY V(b)>0.5
.output (mask) state
.endmachine
* LO1a
* LO0a
* V(phi_)<0
* V(phi_)>=0
* 0
* LO1b
* V(phi_)
* 0
* HI1a
* 1
* HI1b
* 1
* V(phi_)
* LO0b
* HI0a
* HI0b
* 1
* V(phi_)
* |V(phi_)|
* 0
* 1
* |V(phi_)|
* Triple Phase Shift
* Frequency(Hz)
* ΔPhase between clk1* and clk2*(°)
* ΔPhase between clk*a and clk*b(°)
* 2024-12-29
.ends phaseshift3

K Lp Ls 0.999
.tran 0 1m 0.95m 10n
* CLLLC converter - Open-loop
;.save V(vout) V(sw3) V(sw4) V(sw1) V(sw2) V(freq) I(Lr) I(Cout) V(freq)
.ic V(out)=300
* 2024-12-29
.backanno
.end